# Altium schematic sheet [07] - Power_Stage.SchDoc
size A4; DocumentNumber: 8; SheetNumber: 8; SheetTotal: 9
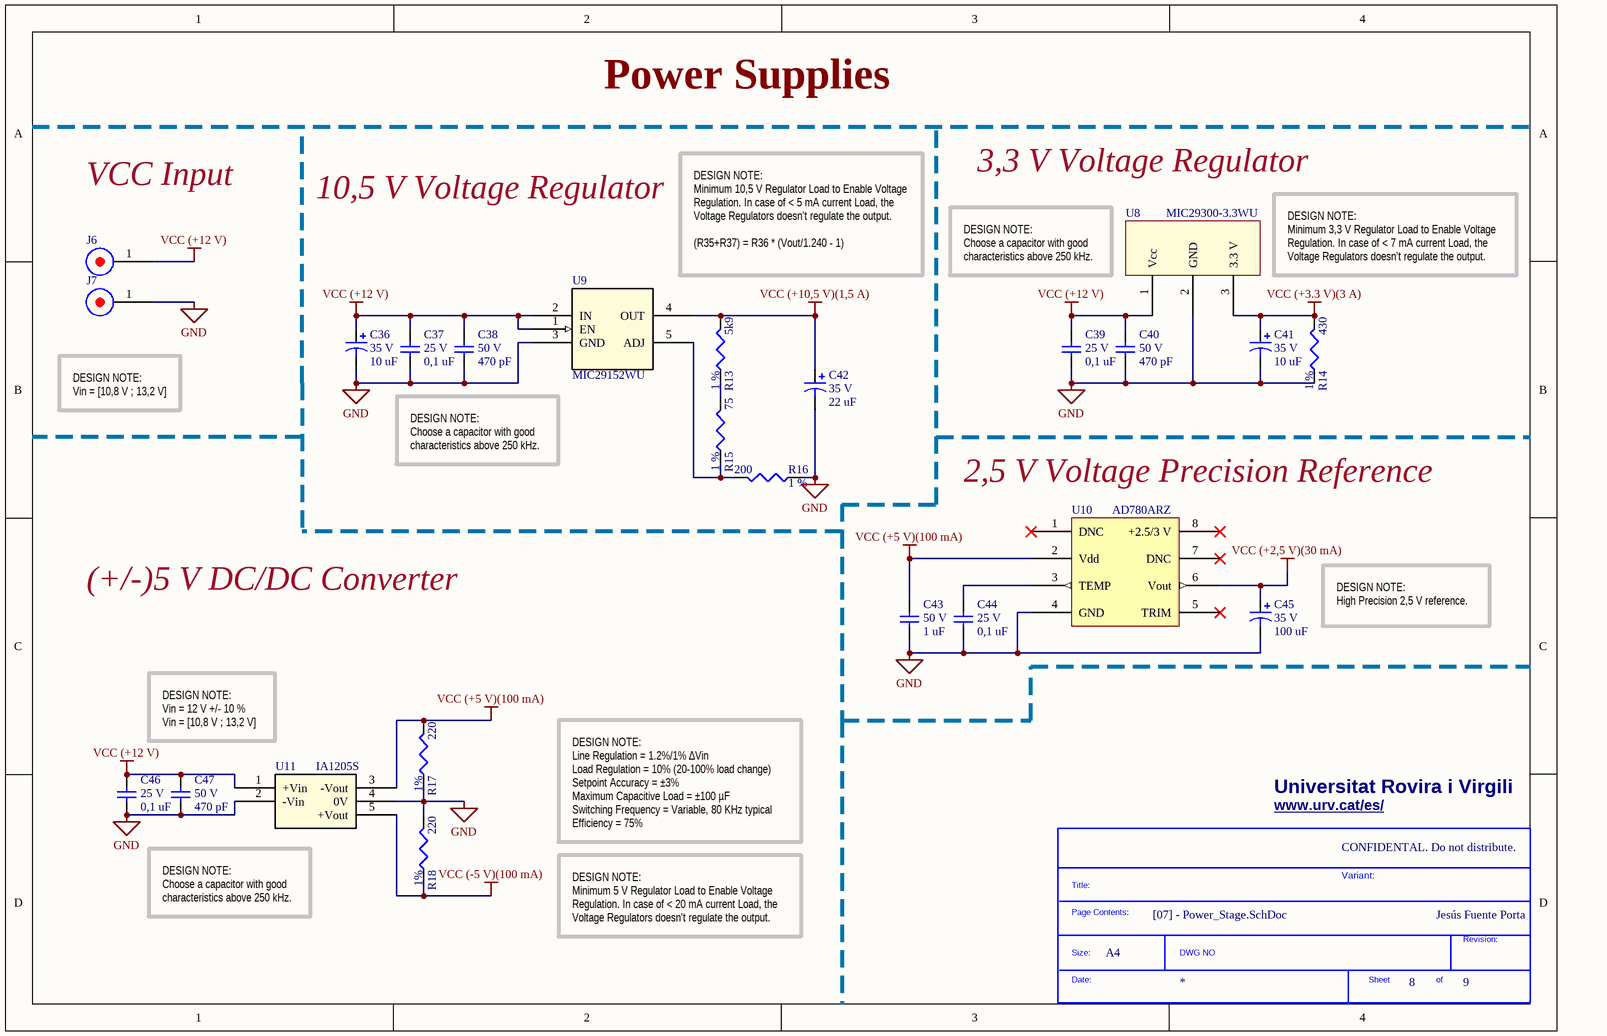
[diagram p0: [07] - Power_Stage.SchDoc]

## Parts
*?  SDTitleBlock  (value not drawn)  (graphical)
C36  10 uF  Voltage: 35 V  [EEE1VA100WR]
C37  0,1 uF  Voltage: 25 V  [1206 [Métrica 3216]]
C38  470 pF  Voltage: 50 V  [1206 [Métrica 3216]]
C39  0,1 uF  Voltage: 25 V  [1206 [Métrica 3216]]
C40  470 pF  Voltage: 50 V  [1206 [Métrica 3216]]
C41  10 uF  Voltage: 35 V  [EEE1VA100WR]
C42  22 uF  Voltage: 35 V  [EEE1VA220WR]
C43  1 uF  Voltage: 50 V  [1206 [Métrica 3216]]
C44  0,1 uF  Voltage: 25 V  [1206 [Métrica 3216]]
C45  100 uF  Voltage: 35 V  [EEE-1VA101XP]
C46  0,1 uF  Voltage: 25 V  [1206 [Métrica 3216]]
C47  470 pF  Voltage: 50 V  [1206 [Métrica 3216]]
J6  RED Banana connector  [Banana Connector]  (value not drawn)
J7  BLACK Banana connector  [Banana Connector]  (value not drawn)
R13  5k9  Tolerance: 1 %  [1206 [Métrica 3216]]
R14  430  Tolerance: 1 %  [1206 [Métrica 3216]]
R15  75  Tolerance: 1 %  [1206 [Métrica 3216]]
R16  200  Tolerance: 1 %  [1206 [Métrica 3216]]
R17  220  Tolerance: 1%  [1206 [Métrica 3216]]
R18  220  Tolerance: 1%  [1206 [Métrica 3216]]
U8  MIC29300-3.3WU  [MIC29300]
U9  MIC29152WU  [MIC29152WU]
U10  AD780ARZ  [AD780ARZ]
U11  IA1205S  [IA0305S]

## Nets
GND: C36.2 C37.2 C38.2 C39.2 C40.2 C41.2 C42.2 C43.2 C44.2 C45.2 C46.2 C47.2 J7.1(IN) R14.2 R16.2 R17.2 R18.1 U8.2(GND) U9.3(GND) U10.4(GND) U11.2(-Vin) U11.4(0V)
VCC (+2,5 V)(30 mA): C45.1 U10.6(Vout)
VCC (+3.3 V)(3 A): C41.1 R14.1 U8.3(3.3_V)
VCC (+5 V)(100 mA): C43.1 R17.1 U10.2(Vdd) U11.3(-Vout)
VCC (+10,5 V)(1,5 A): C42.1 R13.1 U9.4(OUT)
VCC (+12 V): C36.1 C37.1 C38.1 C39.1 C40.1 C46.1 C47.1 J6.1(IN) U8.1(Vcc) U9.1(EN) U9.2(IN) U11.1(+Vin)
VCC (-5 V)(100 mA): R18.2 U11.5(+Vout)
NetC44_1: C44.1 U10.3(TEMP)
NetR13_2: R13.2 R15.1
NetR15_2: R15.2 R16.1 U9.5(ADJ)

Not connected (* = marked no-connect by the designer): U10 1(DNC)* 5(TRIM)* 7(DNC)* 8(+2.5/3_V)*

## Notes on the sheet
- Power Supplies
- 3,3 V Voltage Regulator
- VCC Input
- 10,5 V Voltage Regulator
- DESIGN NOTE:
  Minimum 10,5 V Regulator Load to Enable Voltage Regulation. In case of < 5 mA current Load, the Voltage Regulators doesn't regulate the output.
  (R35+R37) = R36 * (Vout/1.240 - 1)
- (near U8) DESIGN NOTE:
  Choose a capacitor with good characteristics above 250 kHz.
- DESIGN NOTE:
  Minimum 3,3 V Regulator Load to Enable Voltage Regulation. In case of < 7 mA current Load, the Voltage Regulators doesn't regulate the output.
- DESIGN NOTE:
  Vin = [10,8 V ; 13,2 V]
- DESIGN NOTE:
  Choose a capacitor with good characteristics above 250 kHz.
- (near U10) 2,5 V Voltage Precision Reference
- (+/-)5 V DC/DC Converter
- DESIGN NOTE:
  High Precision 2,5 V reference.
- DESIGN NOTE:
  Vin = 12 V +/- 10 %
  Vin = [10,8 V ; 13,2 V]
- Universitat Rovira i Virgili
- DESIGN NOTE:
  Line Regulation = 1.2%/1% ∆Vin
  Load Regulation = 10% (20-100% load change)
  Setpoint Accuracy = ±3%
  Maximum Capacitive Load = ±100 µF
  Switching Frequency = Variable, 80 KHz typical
  Efficiency = 75%
- www.urv.cat/es/ <http://www.urv.cat/es/>
- CONFIDENTAL. Do not distribute.
- Variant:
- Jesús Fuente Porta
- DESIGN NOTE:
  Minimum 5 V Regulator Load to Enable Voltage Regulation. In case of < 20 mA current Load, the Voltage Regulators doesn't regulate the output.
- A4
- (in symbol SDTitleBlock) Title:; Page Contents:; Revision:; Size:; DWG NO; Date:; Sheet; of

## Library data of the parts
C36 C41 = C10uF: EEE1VA100WR -  Condensador Electrolítico Aluminio SMD, Radial - SMD, 10 µF, 35 V, S Series, 1000 horas a 85°C; ComponentLink1Description: Farnell Webpage; ComponentLink1URL: https://es.farnell.com/panasonic/eee1va100wr/conden-10-f-35v-smd/dp/2808004?st=EEE1VA100WR
C37 C39 C44 C46 = C0,1uF: VJ1206Y104KXXCW1BC -  Condensador de Cerámica Multicapa, 0.1 µF, 25 V, 1206 [Métrica 3216], ± 10%, X7R, VJ Series; ComponentLink1Description: Farnell Webpage; ComponentLink1URL: https://es.farnell.com/vishay/vj1206y104kxxcw1bc/conden-0-1-f-25v-10-x7r-1206/dp/2896645
C38 C40 C47 = C470pF: VJ1206A471JXACW1BC -  Condensador de Cerámica Multicapa, 470 pF, 50 V, 1206 [Métrica 3216], ± 5%, C0G / NP0, VJ Series; ComponentLink1Description: Farnell Webpage; ComponentLink1URL: https://es.farnell.com/vishay/vj1206a471jxacw1bc/conden-470pf-50v-5-c0g-np0-1206/dp/2896616
C42 = C22uF: EEE1VA220WR -  Condensador Electrolítico Aluminio SMD, Radial - SMD, 22 µF, 35 V, Serie S, 1000 horas a 85°C; ComponentLink1Description: Farnell Webpage; ComponentLink1URL: https://es.farnell.com/panasonic/eee1va220wr/conden-22-f-35v-radial-smd/dp/2326173?st=EEE1VA220WR
C43 = C1uF: MC1206B105K500CT -  Condensador de Cerámica Multicapa, 1 µF, 50 V, 1206 [Métrica 3216], ± 10%, X7R, Serie MC; ComponentLink1Description: Farnell Webpage; ComponentLink1URL: https://es.farnell.com/multicomp/mcsh31b105k500ct/conden-1-f-50v-10-x7r-1206/dp/1856643
C45 = C100uF: EEE1VA101XP -  Condensador Electrolítico Aluminio SMD, Radial - SMD, 100 µF, 35 V, Serie S, 2000 horas a 85°C; ComponentLink1Description: Farnell Webpage; ComponentLink1URL: https://es.farnell.com/panasonic/eee1va101xp/conden-100-f-35v-radial-smd/dp/2326172?st=EEE1VA101XP
J6 = RED Banana connector: FCR7350R -  Conector Banana de Prueba, 4mm, Hembra, Montaje en PCB, 24 A, 1 kV, Contactos Chapados en Oro; ComponentLink1Description: Farnell Webpage; ComponentLink1URL: https://es.farnell.com/cliff-electronic-components/fcr7350r/toma-pcb-4-mm-r-a-s16n-pc-rojo/dp/1854508
J7 = BLACK Banana connector: FCR7350R -  Conector Banana de Prueba, 4mm, Hembra, Montaje en PCB, 24 A, 1 kV, Contactos Chapados en Oro; ComponentLink1Description: Farnell Webpage; ComponentLink1URL: https://es.farnell.com/cliff-electronic-components/fcr7350b/toma-pcb-4-mm-r-a-s16n-pc-negro/dp/1854507
R13 = R5k9: ERJ8ENF5901V -  Resistencia SMD de Tipo Chip, Película Gruesa, 1206 [Métrica 3216], 5.9 kohm, Serie ERJ8E, 200 V; ComponentLink1Description: Farnell Webpage; ComponentLink1URL: https://es.farnell.com/panasonic/erj8enf5901v/res-5k9-1-0-25w-1206-pel-c-gruesa/dp/2307783
R14 = R430: MCWR12X4300FTL -  Resistencia SMD de Tipo Chip, Película Gruesa, 1206 [Métrica 3216], 430 ohm, Serie MCWR, 200 V; ComponentLink1Description: Farnell Webpage; ComponentLink1URL: https://es.farnell.com/multicomp/mcwr12x4300ftl/res-430r-1-0-25w-1206-pel-c-gruesa/dp/2447518
R15 = R75: ERJ8ENF75R0V -  Resistencia SMD de Tipo Chip, Película Gruesa, 1206 [Métrica 3216], 75 ohm, Serie ERJ8E, 200 V; ComponentLink1Description: Farnell Webpage; ComponentLink1URL: https://es.farnell.com/panasonic/erj8enf75r0v/res-75r-1-0-25w-1206-pel-c-gruesa/dp/2057747
R16 = R200: MCWR12X2000FTL -  Resistencia SMD de Tipo Chip, Película Gruesa, 1206 [Métrica 3216], 200 ohm, Serie MCWR, 200 V; ComponentLink1Description: Farnell Webpage; ComponentLink1URL: https://es.farnell.com/multicomp/mcwr12x2000ftl/res-200r-1-0-25w-1206-pel-c-gruesa/dp/2447482
R17 R18 = R220: MCWR12X2200FTL -  Resistencia SMD de Tipo Chip, Película Gruesa, 1206 [Métrica 3216], 220 ohm, Serie MCWR, 200 V; Manufacturer: Multicomp; Resistance: 220R; Power Rating: 250mW; Voltage Rating: 200V; Temperature Coefficient: 100ppm/°C; Description: MULTICOMP   MCWR12X2200FTL   RES, THICK FILM, 220 OHM, 1%, 0.25W; Supplier 1: Farnell; Manufacturer Part Number: MCWR12X2200FTL; Stock 1: 0; Pricing 1: 150=0.01, 500=0.0071, 1000=0.0055, 2500=0.0045 (EUR); Mount: Surface Mount; Case Code (Metric): 3216; Case Code (Imperial): 1206; Packaging: Tape and Reel; Composition: Thick Film; Voltage Rating (DC): 200V; REACH SVHC: No SVHC; ComponentLink1URL: http://www.farnell.com/datasheets/1849611.pdf?src-supplier=Element14; ComponentLink1Description: http://www.farnell.com/datasheets/1849611.pdf?src-supplier=Element14; Supplier Part Number 1: 2447486RL
U8 = MIC29300-3.3WU: MIC29300-3.3WU -  Regulador de Tensión Fija LDO, 2.5 V a 26 V, Caída de 370 mV, 3.3 Vout, 3 Aout, TO-263-3; ComponentLink1Description: Farnell Webpage; ComponentLink1URL: https://es.farnell.com/microchip/mic29300-3-3wu/ic-reg-ldo-3a-3-3v/dp/2510017?st=MIC29300-3.3WU
U9 = MIC29152WU: MIC29152WU -  Regulador de Tensión LDO, Ajustable, Entrada 2V a 26V, Caída 350mV, Salida 1.27V-25V/1.5A, TO-263-5; Manufacturer_Part_Number: MIC29152BU; Vendor: Micrel; Built_By: EMA_UL_Team; Copyright: Copyright (C) 2018 Accelerated Designs. All rights reserved; RefDes: RefDes; Type: DEV; Value: Value; ComponentLink1Description: Farnell WebPage; ComponentLink1URL: https://es.farnell.com/microchip/mic29152wu/ic-v-reg-ldo-1-5a-adj-smd-29152/dp/2510008?scope=partnumberlookahead&ost=MIC29152WU&searchref=searchlookahead&exaMfpn=true&ddkey=https%3Aes-ES%2FElement14_Spain%2Fw%2Fsearch
U10 = AD780ARZ: AD780CRZ -  Referencia de Tensión, Alta Precisión, Serie - Programable, Serie AD780, 2.5V, 3V, NSOIC-8; ComponentLink1Description: Farnell Webpage; ComponentLink1URL: https://es.farnell.com/analog-devices/ad780arz/ref-de-tensi-n-serie-2-5v-3v-nsoic/dp/2112642?scope=partnumberlookahead&ost=AD780ARZ&searchref=searchlookahead&exaMfpn=true&ddkey=https%3Aes-ES%2FElement14_Spain%2Fw%2Fsearch; ComponentLink2Description: Farnell Webpage (Compatible Chip); ComponentLink2URL: https://es.farnell.com/analog-devices/ad780crz/ref-de-tensi-n-serie-2-5v-3v-nsoic/dp/2461818?st=AD780
U11 = IA1205S: IA1205S -  Convertidor DC/DC Aislado de Montaje en Placa, Orificio Pasante, 1W, 5V, 100mA, -5V, 100mA; Manufacturer_Part_Number: MIC29152BU; Vendor: Micrel; Built_By: EMA_UL_Team; Copyright: Copyright (C) 2018 Accelerated Designs. All rights reserved; RefDes: RefDes; Type: DEV; Value: Value; ComponentLink1Description: Farnell WebPage; ComponentLink1URL: https://es.farnell.com/xp-power/ia1205s/converter-dc-dc-1w-5v/dp/8727546